# EAGLE design Esquematico (EAGLE 7.7.0)
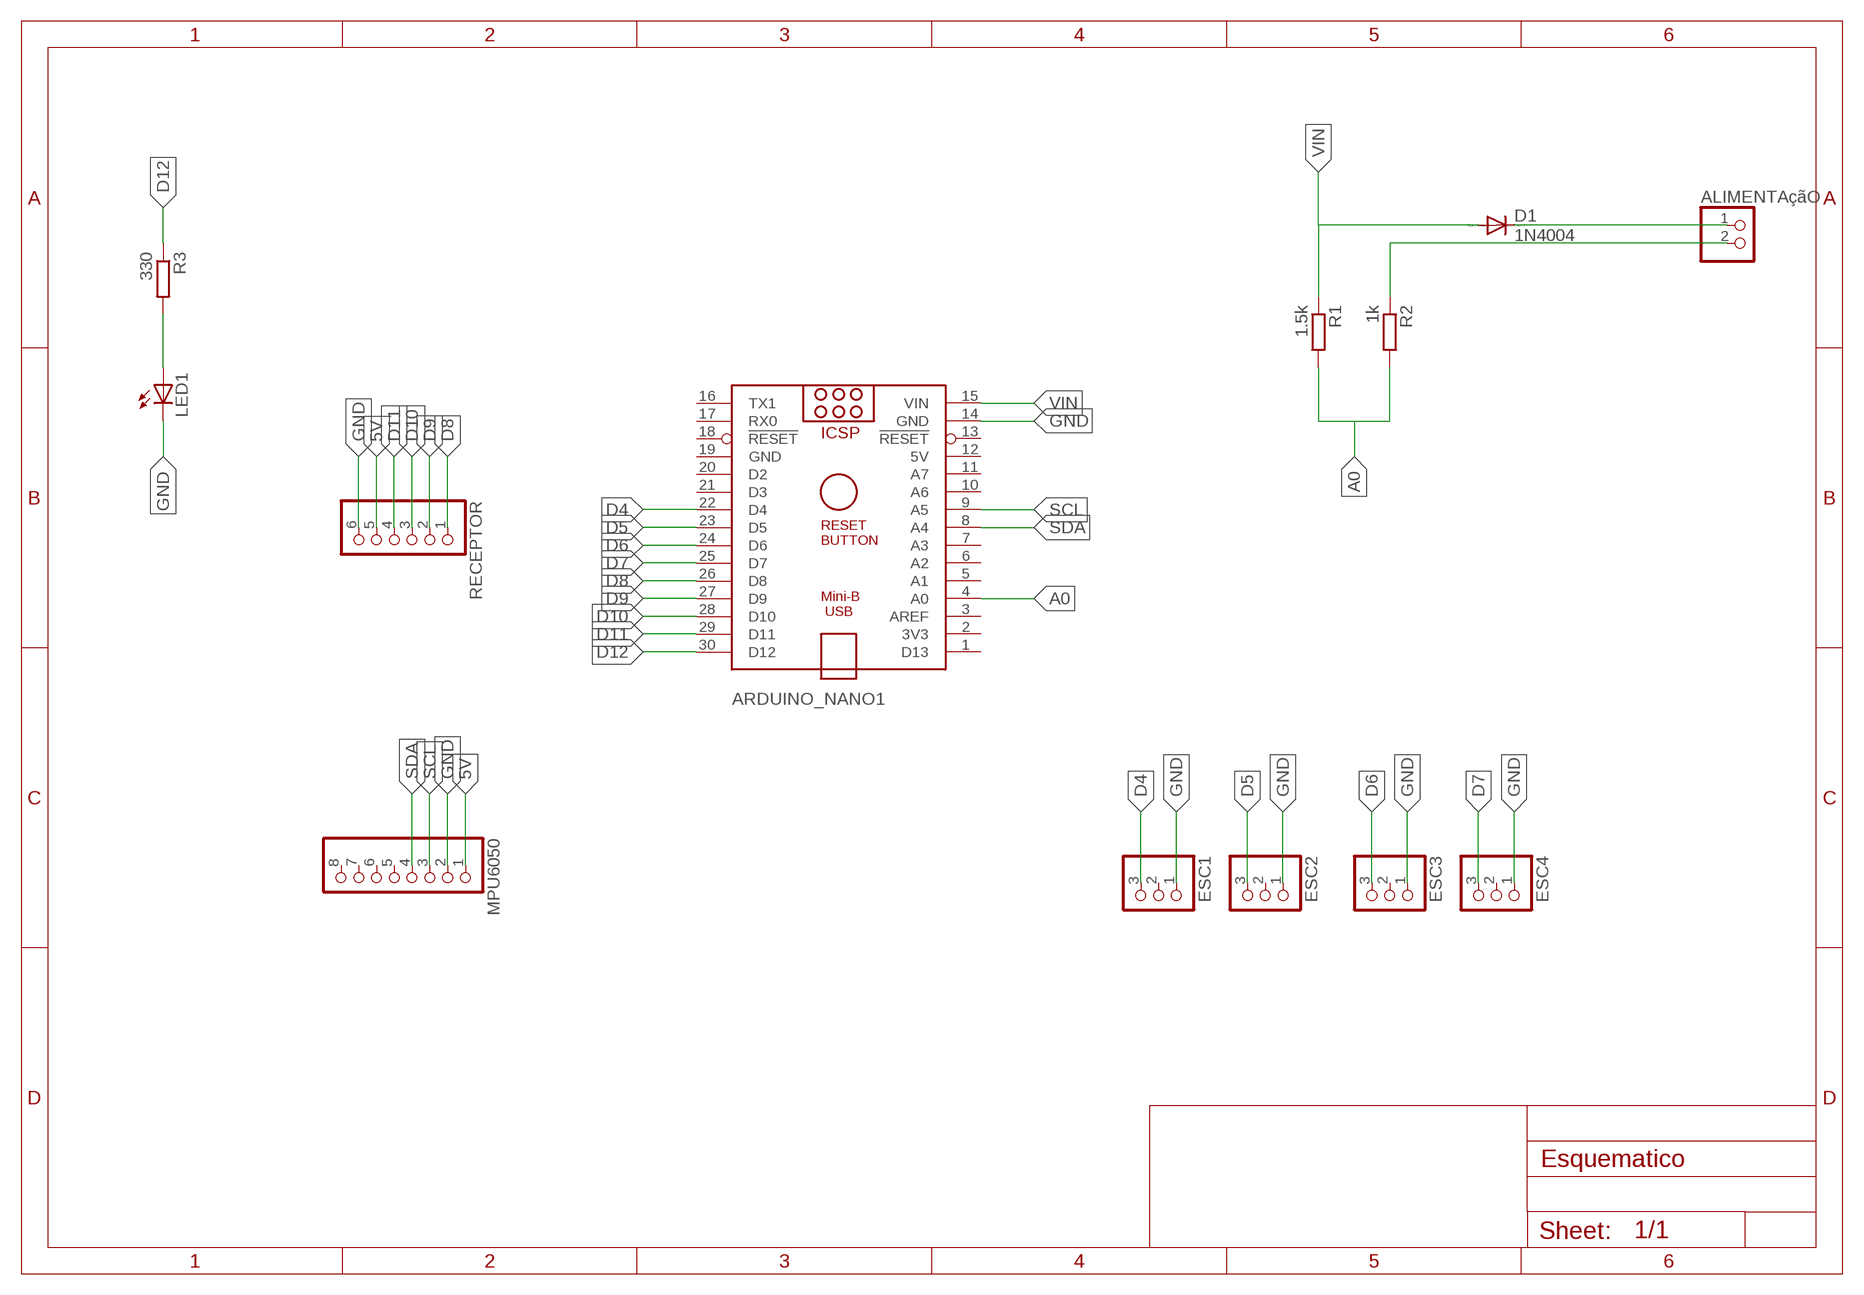
[diagram p0: schematic, sheet 1]

## Parts
ALIMENTAçãO  PINHD-1X2  [1X02]
ARDUINO_NANO1  ARDUINO_NANO  [ARDUINO_NANO]
D1  1N4004  [DO41-10]
ESC1  PINHD-1X3  [1X03]
ESC2  PINHD-1X3  [1X03]
ESC3  PINHD-1X3  [1X03]
ESC4  PINHD-1X3  [1X03]
LED1  LED3MM  [LED3MM]
MPU6050  PINHD-1X8  [1X08]
R1  1.5k  R-EU_0204/7  [0204/7]
R2  1k  R-EU_0204/7  [0204/7]
R3  330  R-EU_0204/7  [0204/7]
RECEPTOR  PINHD-1X6  [1X06]

## Nets
5V: MPU6050.1 RECEPTOR.5
A0: ARDUINO_NANO1.4(A0) R1.2 R2.2
D4: ARDUINO_NANO1.22(D4) ESC1.3
D5: ARDUINO_NANO1.23(D5) ESC2.3
D6: ARDUINO_NANO1.24(D6) ESC3.3
D7: ARDUINO_NANO1.25(D7) ESC4.3
D8: ARDUINO_NANO1.26(D8) RECEPTOR.1
D9: ARDUINO_NANO1.27(D9) RECEPTOR.2
D10: ARDUINO_NANO1.28(D10) RECEPTOR.3
D11: ARDUINO_NANO1.29(D11) RECEPTOR.4
D12: ARDUINO_NANO1.30(D12) R3.1
GND: ARDUINO_NANO1.14(GND) ESC1.1 ESC2.1 ESC3.1 ESC4.1 LED1.K(C) MPU6050.2 RECEPTOR.6
N$1: LED1.A R3.2
N$2: ALIMENTAçãO.1 D1.C
N$4: ALIMENTAçãO.2 R2.1
SCL: ARDUINO_NANO1.9(A5) MPU6050.3
SDA: ARDUINO_NANO1.8(A4) MPU6050.4
VIN: ARDUINO_NANO1.15(VIN) D1.A R1.1
Unconnected: ARDUINO_NANO1.1(D13) ARDUINO_NANO1.2(3V3) ARDUINO_NANO1.3(AREF) ARDUINO_NANO1.5(A1) ARDUINO_NANO1.6(A2) ARDUINO_NANO1.7(A3) ARDUINO_NANO1.10(A6) ARDUINO_NANO1.11(A7) ARDUINO_NANO1.13(!RESET) ARDUINO_NANO1.16(TX1) ARDUINO_NANO1.17(RX0) ARDUINO_NANO1.18(!RESET) ARDUINO_NANO1.20(D2) ARDUINO_NANO1.21(D3) ESC1.2 ESC2.2 ESC3.2 ESC4.2 MPU6050.5 MPU6050.6 MPU6050.7 MPU6050.8

## Power pins joined to a net without a drawn wire
5V: ARDUINO_NANO1.12(5V)
GND: ARDUINO_NANO1.19(GND)

## Library data of the parts
ALIMENTAçãO = pinhead:PINHD-1X2: PIN HEADER
ARDUINO_NANO1 = ArduinoNanoV30:ARDUINO_NANO: Arduino Nano V3.0 Overview: The Arduino Nano is a small, complete, and breadboard-friendly board based on the ATmega328 (Arduino Nano 3.x) or ATmega168 (Arduino Nano 2.x). It has more or less the same functionality of the Arduino Duemilanove, but in a different package. It lacks only a DC power jack, and works with a Mini-B USB cable instead of a standard one. The Nano was designed and is being produced by Gravitech. Specifications: Microcontroller Atmel ATmega168 or ATmega328 Operating Voltage (logic level) 5 V Input Voltage (recommended) 7-12 V Input Voltage (limits) 6-20 V Digital I/O Pins 14 (of which 6 provide PWM output) Analog Input Pins 8 DC Current per I/O Pin 40 mA Flash Memory 16 KB (ATmega168) or 32 KB (ATmega328) of which 2 KB used by bootloader SRAM 1 KB (ATmega168) or 2 KB (ATmega328) EEPROM 512 bytes (ATmega168) or 1 KB (ATmega328) Clock Speed 16 MHz Dimensions 0.73" x 1.70" Length 45 mm Width 18 mm Weigth 5 g Power: The Arduino Nano can be powered via the Mini-B USB connection, 6-20V unregulated external power supply (pin 30), or 5V regulated external power supply (pin 27). The power source is automatically selected to the highest voltage source. Memory: The ATmega168 has 16 KB of flash memory for storing code (of which 2 KB is used for the bootloader); the ATmega328 has 32 KB, (also with 2 KB used for the bootloader). The ATmega168 has 1 KB of SRAM and 512 bytes of EEPROM (which can be read and written with the EEPROM library); the ATmega328 has 2 KB of SRAM and 1 KB of EEPROM. Input and Output: Each of the 14 digital pins on the Nano can be used as an input or output, using pinMode(), digitalWrite(), and digitalRead() functions. They operate at 5 volts. Each pin can provide or receive a maximum of 40 mA and has an internal pull-up resistor (disconnected by default) of 20-50 kOhms. In addition, some pins have specialized functions. Visit Arduino - ArduinoBoardNano <https://www.arduino.cc/en/Main/ArduinoBoardNano>
D1 = diode:1N4004: DIODE general purpose rectifier, 1 A
ESC1-ESC4 = pinhead:PINHD-1X3: PIN HEADER
LED1 = led:LED: LED OSRAM: - CHIPLED LG R971, LG N971, LY N971, LG Q971, LY Q971, LO R971, LY R971 LH N974, LH R974 LS Q976, LO Q976, LY Q976 LO Q996 - Hyper CHIPLED LW Q18S LB Q993, LB Q99A, LB R99A - SideLED LS A670, LO A670, LY A670, LG A670, LP A670 LB A673, LV A673, LT A673, LW A673 LH A674 LY A675 LS A676, LA A676, LO A676, LY A676, LW A676 LS A679, LY A679, LG A679 - Hyper Micro SIDELED® LS Y876, LA Y876, LO Y876, LY Y876 LT Y87S - SmartLED LW L88C, LW L88S LB L89C, LB L89S, LG L890 LS L89K, LO L89K, LY L89K LS L896, LA L896, LO L896, LY L896 - TOPLED LS T670, LO T670, LY T670, LG T670, LP T670 LSG T670, LSP T670, LSY T670, LOP T670, LYG T670 LG T671, LOG T671, LSG T671 LB T673, LV T673, LT T673, LW T673 LH T674 LS T676, LA T676, LO T676, LY T676, LB T676, LH T676, LSB T676, LW T676 LB T67C, LV T67C, LT T67C, LS T67K, LO T67K, LY T67K, LW E67C LS E67B, LA E67B, LO E67B, LY E67B, LB E67C, LV E67C, LT E67C LW T67C LS T679, LY T679, LG T679 LS T770, LO T770, LY T770, LG T770, LP T770 LB T773, LV T773, LT T773, LW T773 LH T774 LS E675, LA E675, LY E675, LS T675 LS T776, LA T776, LO T776, LY T776, LB T776 LHGB T686 LT T68C, LB T68C - Hyper Mini TOPLED® LB M676 - Mini TOPLED Santana® LG M470 LS M47K, LO M47K, LY M47K Source: http://www.osram.convergy.de LUXEON: - LUMILED® LXK2-PW12-R00, LXK2-PW12-S00, LXK2-PW14-U00, LXK2-PW14-V00 LXK2-PM12-R00, LXK2-PM12-S00, LXK2-PM14-U00 LXK2-PE12-Q00, LXK2-PE12-R00, LXK2-PE12-S00, LXK2-PE14-T00, LXK2-PE14-U00 LXK2-PB12-K00, LXK2-PB12-L00, LXK2-PB12-M00, LXK2-PB14-N00, LXK2-PB14-P00, LXK2-PB14-Q00 LXK2-PR12-L00, LXK2-PR12-M00, LXK2-PR14-Q00, LXK2-PR14-R00 LXK2-PD12-Q00, LXK2-PD12-R00, LXK2-PD12-S00 LXK2-PH12-R00, LXK2-PH12-S00 LXK2-PL12-P00, LXK2-PL12-Q00, LXK2-PL12-R00 Source: www.luxeon.com KINGBRIGHT: KA-3528ASYC Source: www.kingbright.com
MPU6050 = pinhead:PINHD-1X8: PIN HEADER
R1-R3 = resistor:R-EU_: RESISTOR, European symbol
RECEPTOR = pinhead:PINHD-1X6: PIN HEADER

## Board
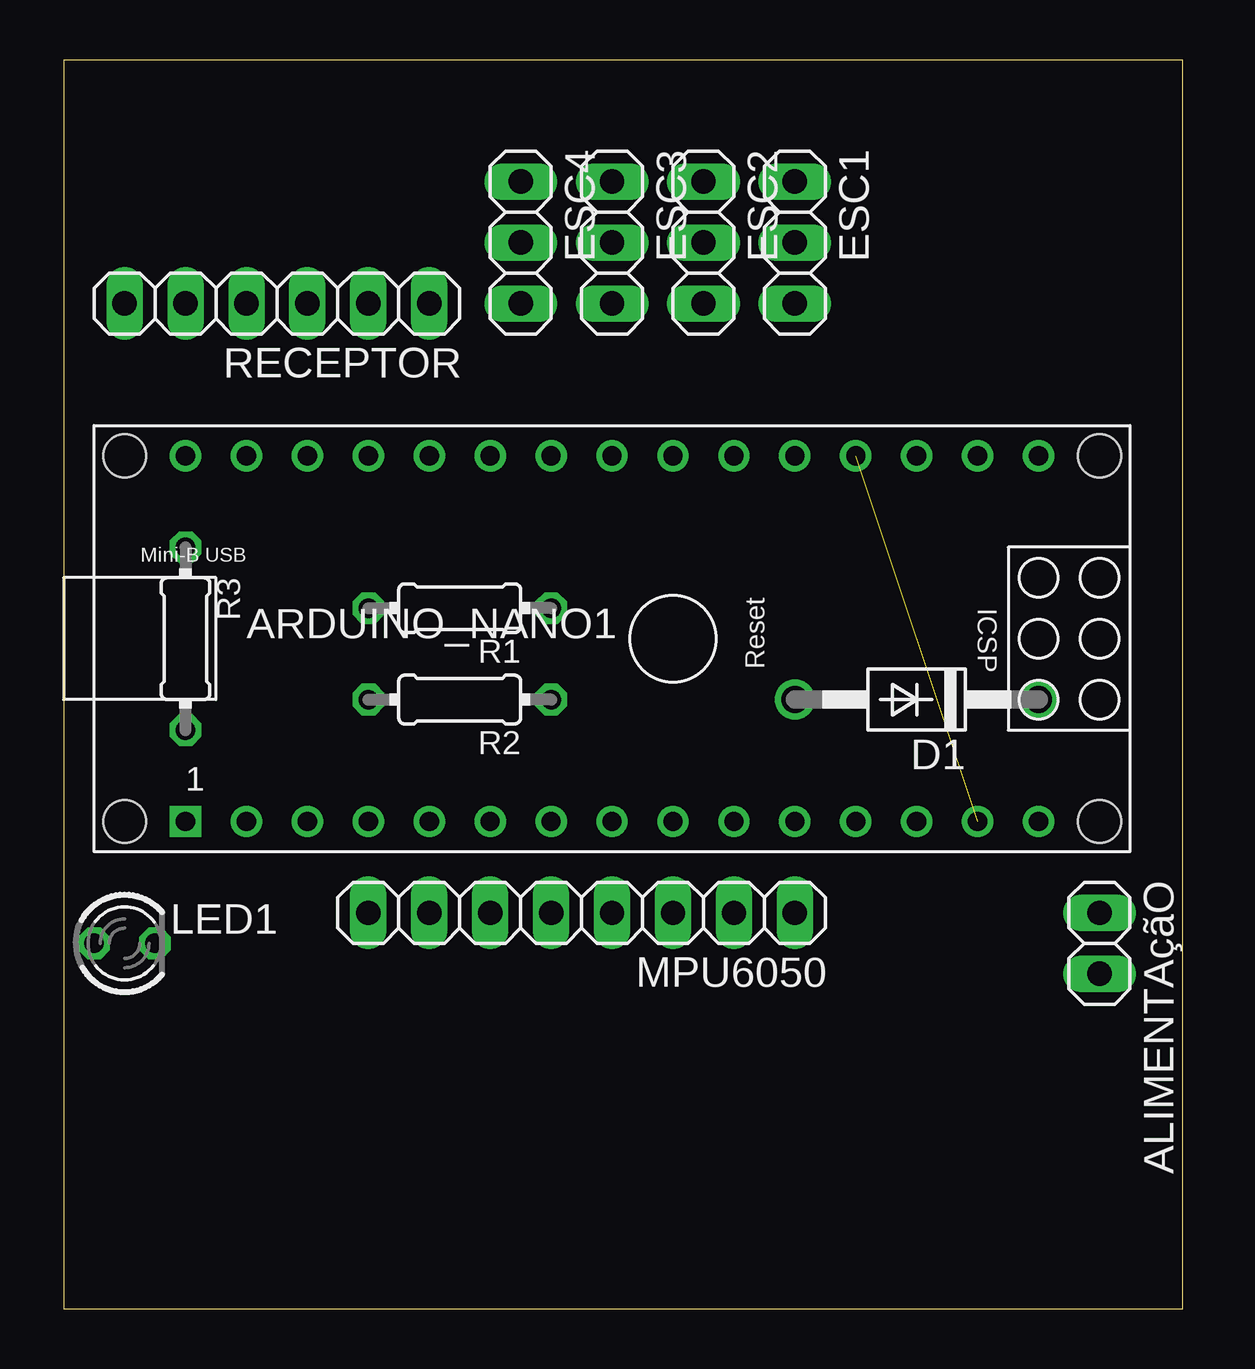
[diagram p1: board, top side]
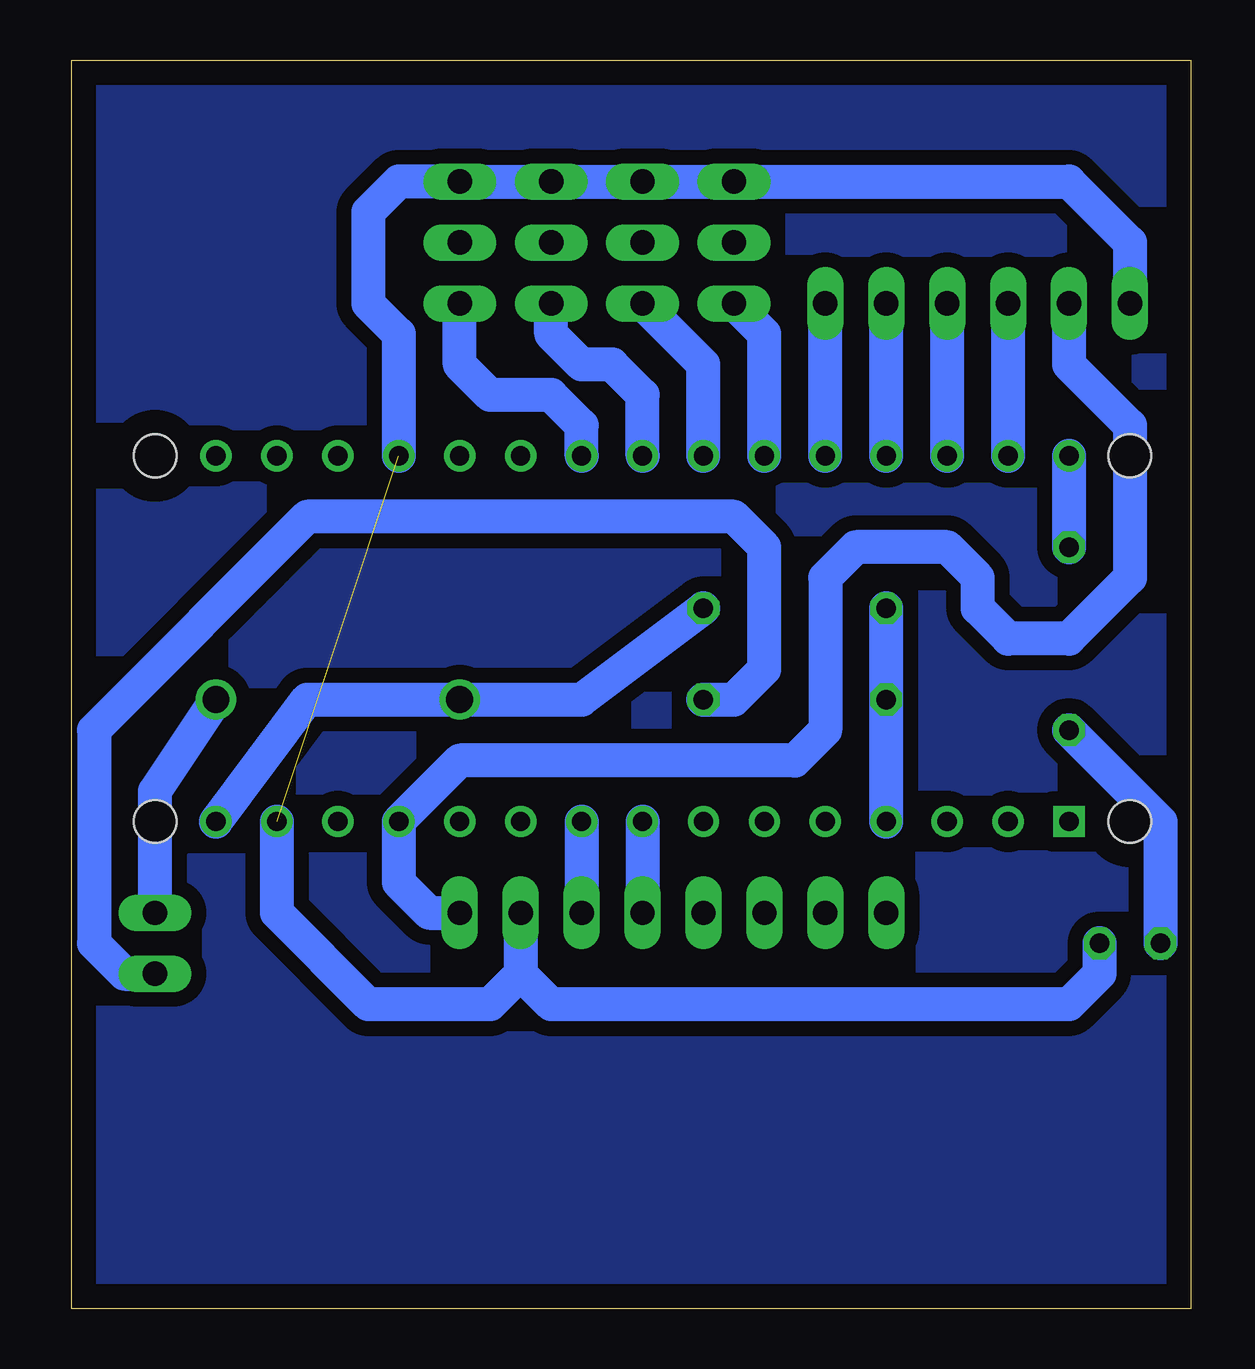
[diagram p2: board, bottom side, seen from below]

Size 46.66 x 52.06 mm. Coordinates in mm from the lower left corner, seen from the top.
Outline: 0,0 46.66,0 46.66,52.06 0,52.06 0,0
Copper layers (1*16): layer 1 0.035mm / dielectric 1.5mm / Bottom 0.035mm
Design rules "default": minimum track width 10mil, minimum drill 24mil, track to track 8mil, track to pad 8mil, pad to pad 8mil, via to via 8mil, smd to smd 8mil, copper to edge 40mil, drill to drill 8mil, minimum pad ring 10mil, minimum via ring 8mil, stop-mask expansion 4mil, vias tented up to drill 0mil, thermal gap 10mil

### Footprints (pad centres in the part's own frame; a part is rotated, then mirrored left to right if it is on the bottom)
1X02 = drill 1.016 long: 1 -1.27,0; 2 1.27,0
ARDUINO_NANO = drill 0.8 square: 1 -20.32,-7.62 | drill 0.8: 2 -17.78,-7.62; 3 -15.24,-7.62; 4 -12.7,-7.62; 5 -10.16,-7.62; 6 -7.62,-7.62; 7 -5.08,-7.62; 8 -2.54,-7.62; 9 0,-7.62; 10 2.54,-7.62; 11 5.08,-7.62; 12 7.62,-7.62; 13 10.16,-7.62; 14 12.7,-7.62; 15 15.24,-7.62; 16 15.24,7.62; 17 12.7,7.62; 18 10.16,7.62; 19 7.62,7.62; 20 5.08,7.62; 21 2.54,7.62; 22 0,7.62; 23 -2.54,7.62; 24 -5.08,7.62; 25 -7.62,7.62; 26 -10.16,7.62; 27 -12.7,7.62; 28 -15.24,7.62; 29 -17.78,7.62; 30 -20.32,7.62 | hole 1.778: -22.86,-7.62; -22.86,7.62; 17.78,7.62; 17.78,-7.62
DO41-10 = drill 1.118: A 5.08,0; C -5.08,0
1X03 = drill 1.016 long: 1 -2.54,0; 2 0,0; 3 2.54,0
LED3MM = drill 0.813 octagon: A -1.27,0; K 1.27,0
1X08 = drill 1.016 long: 1 -8.89,0; 2 -6.35,0; 3 -3.81,0; 4 -1.27,0; 5 1.27,0; 6 3.81,0; 7 6.35,0; 8 8.89,0
0204/7 = drill 0.813 octagon: 1 -3.81,0; 2 3.81,0
1X06 = drill 1.016 long: 1 -6.35,0; 2 -3.81,0; 3 -1.27,0; 4 1.27,0; 5 3.81,0; 6 6.35,0

### Placement (x,y rotation side)
ALIMENTAçãO  43.18,15.24 270 top
ARDUINO_NANO1  25.4,27.94 0 top
D1  35.56,25.4 180 top
ESC1  30.48,44.45 270 top
ESC2  26.67,44.45 270 top
ESC3  22.86,44.45 270 top
ESC4  19.05,44.45 270 top
LED1  2.54,15.24 0 top
MPU6050  21.59,16.51 180 top
R1  16.51,29.21 180 top
R2  16.51,25.4 180 top
R3  5.08,27.94 270 top
RECEPTOR  8.89,41.91 180 top

### Tracks (layer width: path | path; a pad name or v marks a point on that pad's centre or on a via)
5V
  Bottom 1.422: MPU6050.1 31.75,16.51 33.02,17.78 ARDUINO_NANO1.12 30.48,22.86 16.51,22.86 15.24,24.13 15.24,30.48 13.97,31.75 10.16,31.75 8.89,30.48 8.89,29.21 7.62,27.94 5.08,27.94 2.54,30.48 2.54,36.83 5.08,39.37 RECEPTOR.5
A0
  Bottom 1.422: ARDUINO_NANO1.4 R2.2 R1.2
D4
  Bottom 1.422: ARDUINO_NANO1.22 25.4,36.83 26.67,38.1 29.21,38.1 30.48,39.37 ESC1.3
D5
  Bottom 1.422: ARDUINO_NANO1.23 22.86,38.1 24.13,39.37 25.4,39.37 26.67,40.64 ESC2.3
D6
  Bottom 1.422: ARDUINO_NANO1.24 20.32,39.37 ESC3.3
D7
  Bottom 1.422: ARDUINO_NANO1.25 17.78,40.64 ESC4.3
D8
  Bottom 1.422: ARDUINO_NANO1.26 RECEPTOR.1
D9
  Bottom 1.422: ARDUINO_NANO1.27 RECEPTOR.2
D10
  Bottom 1.422: ARDUINO_NANO1.28 RECEPTOR.3
D11
  Bottom 1.422: ARDUINO_NANO1.29 RECEPTOR.4
D12
  Bottom 1.422: ARDUINO_NANO1.30 R3.1
GND  (1 unrouted)
  Bottom 1.422: RECEPTOR.6 2.54,44.45 5.08,46.99 ESC4.1 ESC3.1 ESC2.1 ESC1.1 33.02,46.99 34.29,45.72 34.29,41.91 33.02,40.64 ARDUINO_NANO1.19 | MPU6050.2 27.94,13.97 | 27.94,13.97 29.21,12.7 34.29,12.7 38.1,16.51 ARDUINO_NANO1.14 | LED1.K 3.81,13.97 5.08,12.7 26.67,12.7 27.94,13.97
N$1
  Bottom 1.422: R3.2 1.27,20.32 LED1.A
N$2
  Bottom 1.422: ALIMENTAçãO.1 43.18,21.59 D1.C
N$3
  pour Bottom (isolate 0.61): 0,0 0,52.07 46.99,52.07 46.99,0
N$4
  Bottom 1.422: R2.1 19.05,25.4 17.78,26.67 17.78,31.75 19.05,33.02 36.83,33.02 45.72,24.13 45.72,15.24 44.45,13.97 ALIMENTAçãO.2
SCL
  Bottom 1.422: ARDUINO_NANO1.9 MPU6050.3
SDA
  Bottom 1.422: ARDUINO_NANO1.8 MPU6050.4
VIN
  Bottom 1.422: ARDUINO_NANO1.15 36.83,25.4 D1.A 25.4,25.4 R1.1